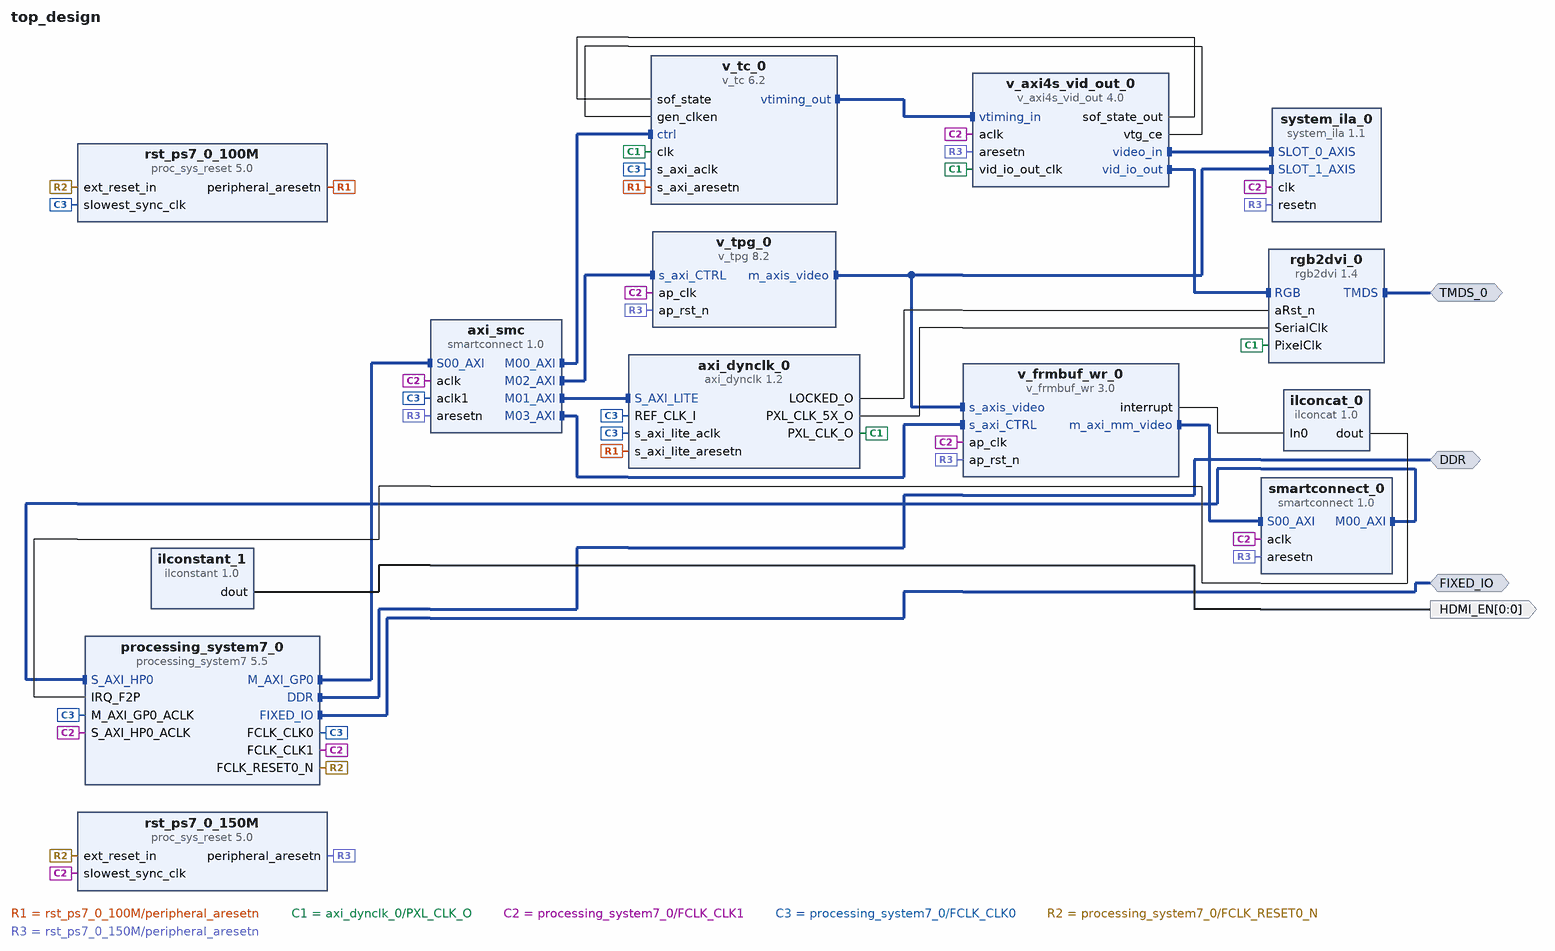
[diagram p0: block diagram of the top level]
# Vivado block design top_design, xc7z020clg400-2, Vivado 2025.2
create_bd_design top_design

create_bd_intf_port -mode Master -vlnv xilinx.com:interface:ddrx_rtl:1.0 DDR
create_bd_intf_port -mode Master -vlnv xilinx.com:display_processing_system7:fixedio_rtl:1.0 FIXED_IO
create_bd_intf_port -mode Master -vlnv digilentinc.com:interface:tmds_rtl:1.0 TMDS_0
create_bd_port -dir O -from 0 -to 0 HDMI_EN

create_bd_cell -type ip -vlnv xilinx.com:ip:processing_system7:5.5 processing_system7_0
set_property -dict [list \
  CONFIG.PCW_APU_PERIPHERAL_FREQMHZ 666.666666 \
  CONFIG.PCW_CPU_CPU_6X4X_MAX_RANGE 767 \
  CONFIG.PCW_ENET0_PERIPHERAL_ENABLE 0 \
  CONFIG.PCW_EN_CLK1_PORT 1 \
  CONFIG.PCW_FCLK1_PERIPHERAL_CLKSRC {ARM PLL} \
  CONFIG.PCW_FCLK_CLK0_BUF FALSE \
  CONFIG.PCW_FCLK_CLK1_BUF TRUE \
  CONFIG.PCW_FPGA0_PERIPHERAL_FREQMHZ 100 \
  CONFIG.PCW_FPGA1_PERIPHERAL_FREQMHZ 148.5 \
  CONFIG.PCW_FPGA_FCLK1_ENABLE 1 \
  CONFIG.PCW_GPIO_MIO_GPIO_ENABLE 0 \
  CONFIG.PCW_IRQ_F2P_INTR 1 \
  CONFIG.PCW_PERIPHERAL_BOARD_PRESET None \
  CONFIG.PCW_PRESET_BANK1_VOLTAGE {LVCMOS 1.8V} \
  CONFIG.PCW_QSPI_PERIPHERAL_ENABLE 0 \
  CONFIG.PCW_SD0_PERIPHERAL_ENABLE 0 \
  CONFIG.PCW_S_AXI_HP0_DATA_WIDTH 32 \
  CONFIG.PCW_TTC0_PERIPHERAL_ENABLE 1 \
  CONFIG.PCW_TTC0_TTC0_IO EMIO \
  CONFIG.PCW_TTC1_PERIPHERAL_ENABLE 1 \
  CONFIG.PCW_TTC1_TTC1_IO EMIO \
  CONFIG.PCW_UART1_PERIPHERAL_ENABLE 1 \
  CONFIG.PCW_UART1_UART1_IO {MIO 48 .. 49} \
  CONFIG.PCW_UART_PERIPHERAL_FREQMHZ 100 \
  CONFIG.PCW_UIPARAM_DDR_BUS_WIDTH {16 Bit} \
  CONFIG.PCW_UIPARAM_DDR_FREQ_MHZ 533.333333 \
  CONFIG.PCW_UIPARAM_DDR_PARTNO {MT41J256M16 RE-125} \
  CONFIG.PCW_UIPARAM_GENERATE_SUMMARY NONE \
  CONFIG.PCW_USB0_PERIPHERAL_ENABLE 0 \
  CONFIG.PCW_USE_FABRIC_INTERRUPT 1 \
  CONFIG.PCW_USE_S_AXI_HP0 1 \
  CONFIG.preset None \
] [get_bd_cells processing_system7_0]
# 342 more settings of processing_system7_0 are not shown: defaults, MIO pin electricals, DDR timing, and values the tool derives
create_bd_cell -type ip -vlnv xilinx.com:ip:v_tpg:8.2 v_tpg_0
set_property -dict {CONFIG.MAX_COLS 1920 CONFIG.MAX_ROWS 1080} [get_bd_cells v_tpg_0]
create_bd_cell -type ip -vlnv xilinx.com:ip:smartconnect:1.0 axi_smc
set_property -dict {CONFIG.NUM_CLKS 2 CONFIG.NUM_MI 4 CONFIG.NUM_SI 1} [get_bd_cells axi_smc]
create_bd_cell -type ip -vlnv xilinx.com:ip:proc_sys_reset:5.0 rst_ps7_0_150M
create_bd_cell -type ip -vlnv xilinx.com:ip:v_axi4s_vid_out:4.0 v_axi4s_vid_out_0
set_property -dict {CONFIG.C_HAS_ASYNC_CLK 1} [get_bd_cells v_axi4s_vid_out_0]
create_bd_cell -type ip -vlnv xilinx.com:ip:v_tc:6.2 v_tc_0
set_property -dict {CONFIG.HAS_AXI4_LITE true CONFIG.VIDEO_MODE 1080p CONFIG.enable_detection false} [get_bd_cells v_tc_0]
create_bd_cell -type ip -vlnv digilentinc.com:ip:rgb2dvi:1.4 rgb2dvi_0
set_property -dict {CONFIG.kGenerateSerialClk false CONFIG.kRstActiveHigh false} [get_bd_cells rgb2dvi_0]
create_bd_cell -type inline_hdl -vlnv xilinx.com:inline_hdl:ilconstant:1.0 ilconstant_1
create_bd_cell -type ip -vlnv digilentinc.com:ip:axi_dynclk:1.2 axi_dynclk_0
create_bd_cell -type ip -vlnv xilinx.com:ip:proc_sys_reset:5.0 rst_ps7_0_100M
create_bd_cell -type ip -vlnv xilinx.com:ip:system_ila:1.1 system_ila_0
set_property -dict [list \
  CONFIG.C_NUM_MONITOR_SLOTS 2 \
  CONFIG.C_SLOT 1 \
  CONFIG.C_SLOT_0_INTF_TYPE xilinx.com:interface:axis_rtl:1.0 \
  CONFIG.C_SLOT_1_INTF_TYPE xilinx.com:interface:axis_rtl:1.0 \
] [get_bd_cells system_ila_0]
create_bd_cell -type ip -vlnv xilinx.com:ip:v_frmbuf_wr:3.0 v_frmbuf_wr_0
set_property -dict {CONFIG.MAX_COLS 1920 CONFIG.MAX_ROWS 1080 CONFIG.SAMPLES_PER_CLOCK 1} [get_bd_cells v_frmbuf_wr_0]
create_bd_cell -type ip -vlnv xilinx.com:ip:smartconnect:1.0 smartconnect_0
set_property -dict {CONFIG.NUM_SI 1} [get_bd_cells smartconnect_0]
create_bd_cell -type inline_hdl -vlnv xilinx.com:inline_hdl:ilconcat:1.0 ilconcat_0
set_property -dict {CONFIG.NUM_PORTS 1} [get_bd_cells ilconcat_0]

# ---- connections ----

connect_bd_intf_net [get_bd_intf_pins v_tc_0/ctrl] [get_bd_intf_pins axi_smc/M00_AXI]
connect_bd_intf_net [get_bd_intf_pins axi_smc/M01_AXI] [get_bd_intf_pins axi_dynclk_0/S_AXI_LITE]
connect_bd_intf_net [get_bd_intf_pins axi_smc/M02_AXI] [get_bd_intf_pins v_tpg_0/s_axi_CTRL]
connect_bd_intf_net [get_bd_intf_pins v_frmbuf_wr_0/s_axi_CTRL] [get_bd_intf_pins axi_smc/M03_AXI]
connect_bd_intf_net [get_bd_intf_ports DDR] [get_bd_intf_pins processing_system7_0/DDR]
connect_bd_intf_net [get_bd_intf_ports FIXED_IO] [get_bd_intf_pins processing_system7_0/FIXED_IO]
connect_bd_intf_net [get_bd_intf_pins processing_system7_0/M_AXI_GP0] [get_bd_intf_pins axi_smc/S00_AXI]
connect_bd_intf_net [get_bd_intf_ports TMDS_0] [get_bd_intf_pins rgb2dvi_0/TMDS]
connect_bd_intf_net [get_bd_intf_pins smartconnect_0/M00_AXI] [get_bd_intf_pins processing_system7_0/S_AXI_HP0]
connect_bd_intf_net [get_bd_intf_pins v_axi4s_vid_out_0/vid_io_out] [get_bd_intf_pins rgb2dvi_0/RGB]
connect_bd_intf_net [get_bd_intf_pins v_frmbuf_wr_0/m_axi_mm_video] [get_bd_intf_pins smartconnect_0/S00_AXI]
connect_bd_intf_net [get_bd_intf_pins v_tc_0/vtiming_out] [get_bd_intf_pins v_axi4s_vid_out_0/vtiming_in]
connect_bd_intf_net -intf_net v_tpg_0_m_axis_video [get_bd_intf_pins v_axi4s_vid_out_0/video_in] [get_bd_intf_pins system_ila_0/SLOT_0_AXIS]
connect_bd_intf_net [get_bd_intf_pins v_tpg_0/m_axis_video] [get_bd_intf_pins v_frmbuf_wr_0/s_axis_video]
connect_bd_intf_net [get_bd_intf_pins v_tpg_0/m_axis_video] [get_bd_intf_pins system_ila_0/SLOT_1_AXIS]
connect_bd_net [get_bd_pins rst_ps7_0_100M/peripheral_aresetn] [get_bd_pins axi_dynclk_0/s_axi_lite_aresetn] [get_bd_pins v_tc_0/s_axi_aresetn]
connect_bd_net [get_bd_pins axi_dynclk_0/LOCKED_O] [get_bd_pins rgb2dvi_0/aRst_n]
connect_bd_net [get_bd_pins axi_dynclk_0/PXL_CLK_5X_O] [get_bd_pins rgb2dvi_0/SerialClk]
connect_bd_net [get_bd_pins axi_dynclk_0/PXL_CLK_O] \
  [get_bd_pins rgb2dvi_0/PixelClk] [get_bd_pins v_tc_0/clk] [get_bd_pins v_axi4s_vid_out_0/vid_io_out_clk]
connect_bd_net [get_bd_pins ilconcat_0/dout] [get_bd_pins processing_system7_0/IRQ_F2P]
connect_bd_net [get_bd_pins ilconstant_1/dout] [get_bd_ports HDMI_EN]
connect_bd_net [get_bd_pins processing_system7_0/FCLK_CLK1] \
  [get_bd_pins axi_smc/aclk] [get_bd_pins v_tpg_0/ap_clk] [get_bd_pins rst_ps7_0_150M/slowest_sync_clk] \
  [get_bd_pins v_axi4s_vid_out_0/aclk] [get_bd_pins processing_system7_0/S_AXI_HP0_ACLK] [get_bd_pins system_ila_0/clk] \
  [get_bd_pins v_frmbuf_wr_0/ap_clk] [get_bd_pins smartconnect_0/aclk]
connect_bd_net [get_bd_pins processing_system7_0/FCLK_CLK0] \
  [get_bd_pins processing_system7_0/M_AXI_GP0_ACLK] [get_bd_pins rst_ps7_0_100M/slowest_sync_clk] \
  [get_bd_pins axi_dynclk_0/REF_CLK_I] [get_bd_pins axi_dynclk_0/s_axi_lite_aclk] [get_bd_pins v_tc_0/s_axi_aclk] \
  [get_bd_pins axi_smc/aclk1]
connect_bd_net [get_bd_pins processing_system7_0/FCLK_RESET0_N] [get_bd_pins rst_ps7_0_150M/ext_reset_in] [get_bd_pins rst_ps7_0_100M/ext_reset_in]
connect_bd_net -net rst_ps7_0_148M_peripheral_aresetn [get_bd_pins rst_ps7_0_150M/peripheral_aresetn] \
  [get_bd_pins axi_smc/aresetn] [get_bd_pins v_axi4s_vid_out_0/aresetn] [get_bd_pins v_tpg_0/ap_rst_n] \
  [get_bd_pins system_ila_0/resetn] [get_bd_pins v_frmbuf_wr_0/ap_rst_n] [get_bd_pins smartconnect_0/aresetn]
connect_bd_net [get_bd_pins v_axi4s_vid_out_0/sof_state_out] [get_bd_pins v_tc_0/sof_state]
connect_bd_net [get_bd_pins v_axi4s_vid_out_0/vtg_ce] [get_bd_pins v_tc_0/gen_clken]
connect_bd_net [get_bd_pins v_frmbuf_wr_0/interrupt] [get_bd_pins ilconcat_0/In0]

# ---- address map ----
assign_bd_address -offset 0x43C00000 -range 64K -target_address_space [get_bd_addr_spaces processing_system7_0/Data] [get_bd_addr_segs v_tpg_0/s_axi_CTRL/Reg]
assign_bd_address -offset 0x43C10000 -range 64K -target_address_space [get_bd_addr_spaces processing_system7_0/Data] [get_bd_addr_segs axi_dynclk_0/S_AXI_LITE/S_AXI_LITE_reg]
assign_bd_address -offset 0x43C20000 -range 64K -target_address_space [get_bd_addr_spaces processing_system7_0/Data] [get_bd_addr_segs v_tc_0/ctrl/Reg]
assign_bd_address -offset 0x43C30000 -range 64K -target_address_space [get_bd_addr_spaces processing_system7_0/Data] [get_bd_addr_segs v_frmbuf_wr_0/s_axi_CTRL/Reg]
assign_bd_address -offset 0x00000000 -range 512M -target_address_space [get_bd_addr_spaces v_frmbuf_wr_0/Data_m_axi_mm_video] [get_bd_addr_segs processing_system7_0/S_AXI_HP0/HP0_DDR_LOWOCM]

validate_bd_design
save_bd_design
